# EAGLE schematic logic (EAGLE 9.6.2)
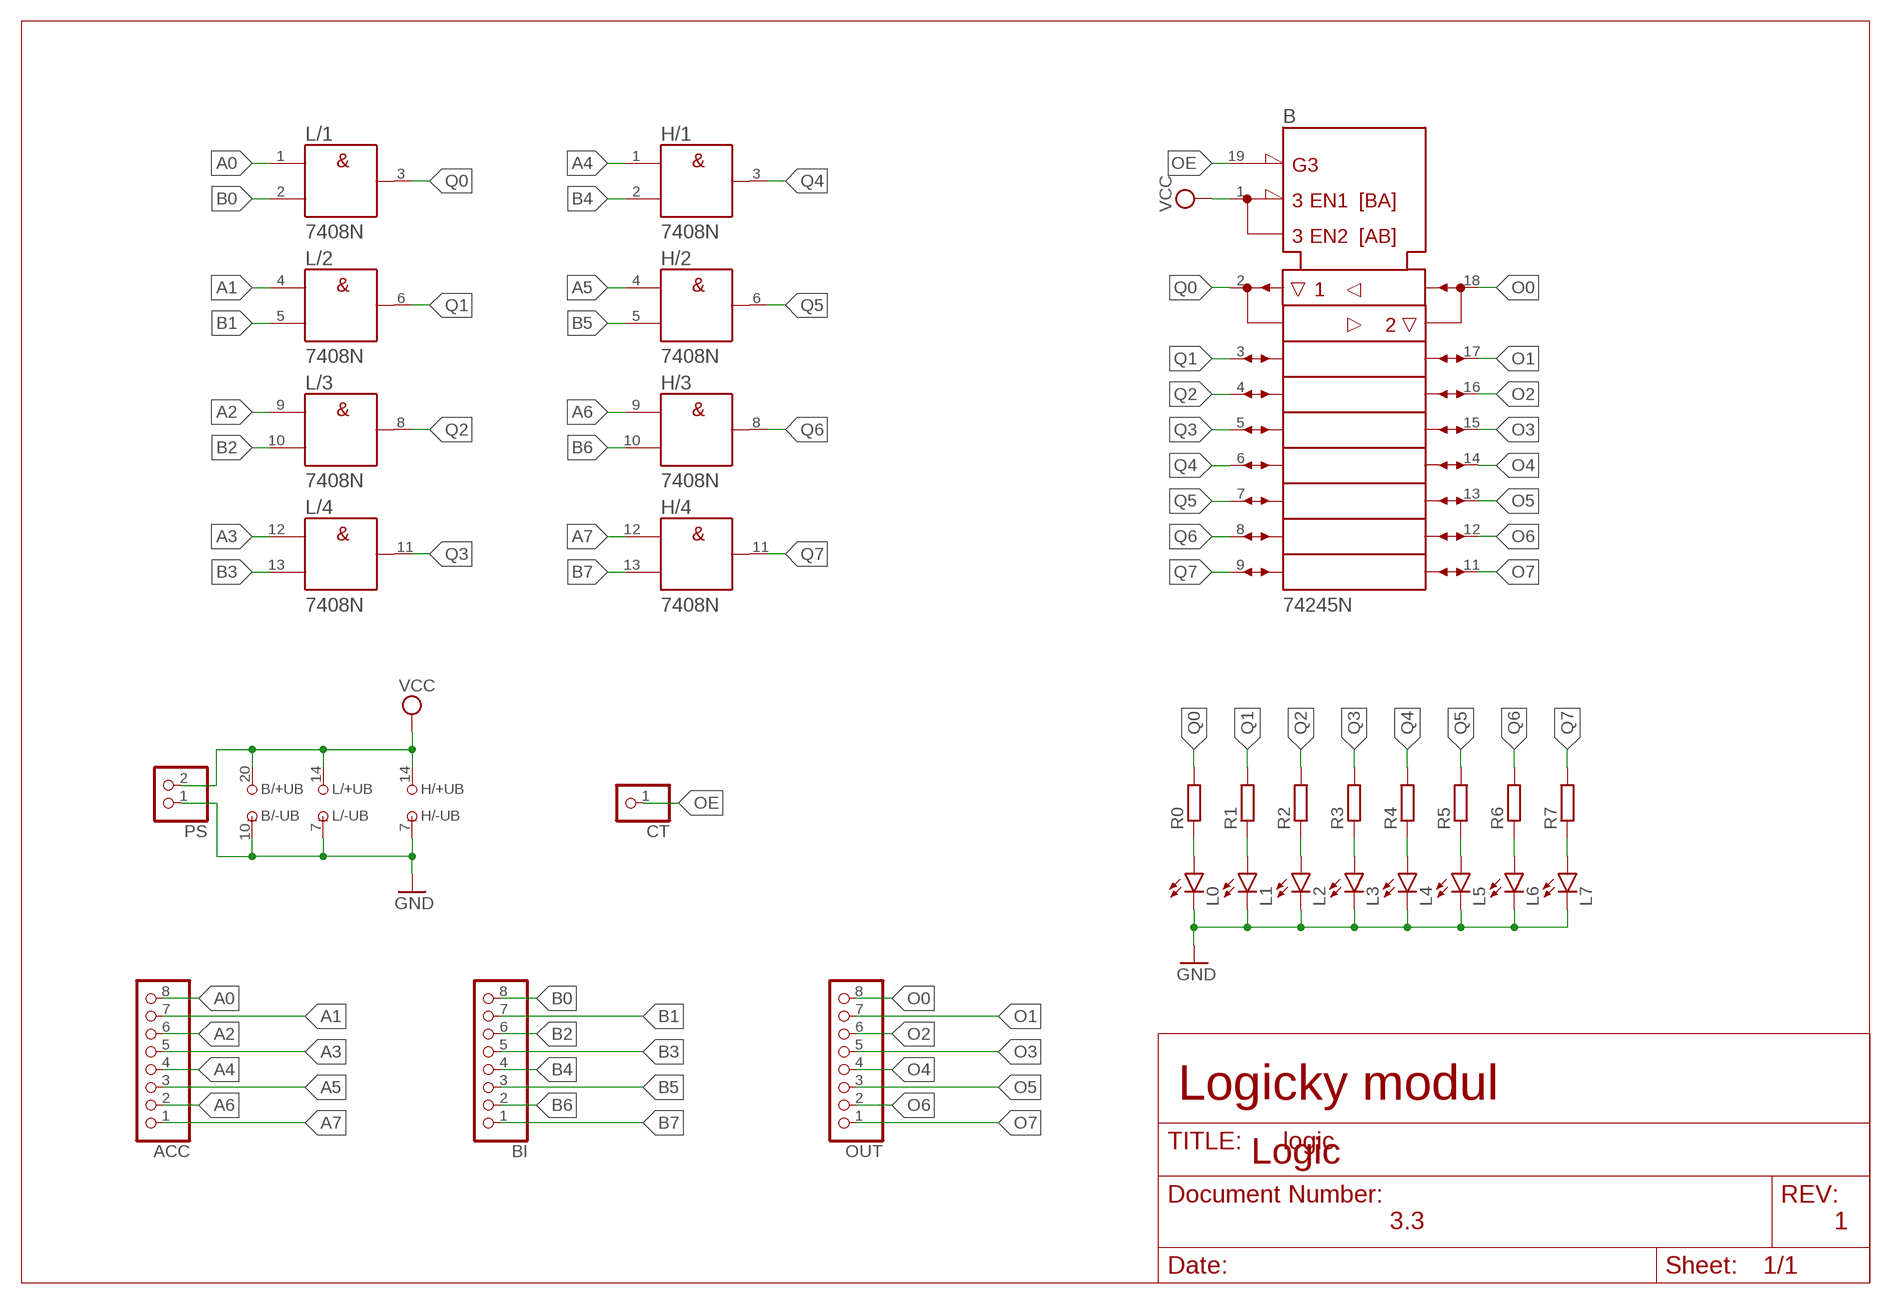
[diagram p0: schematic, sheet 1]

## Parts
ACC  PINHD-1X8  [1X08]
B  74245N  [DIL20]
BI  PINHD-1X8  [1X08]
CT  PINHD-1X1  [1X01]
H  7408N  [DIL14]
L  7408N  [DIL14]
L0  LED5MM  [LED5MM]
L1  LED5MM  [LED5MM]
L2  LED5MM  [LED5MM]
L3  LED5MM  [LED5MM]
L4  LED5MM  [LED5MM]
L5  LED5MM  [LED5MM]
L6  LED5MM  [LED5MM]
L7  LED5MM  [LED5MM]
OUT  PINHD-1X8  [1X08]
PS  PINHD-1X2  [1X02]
R0  R-EU_0204/7  [0204/7]
R1  R-EU_0204/7  [0204/7]
R2  R-EU_0204/7  [0204/7]
R3  R-EU_0204/7  [0204/7]
R4  R-EU_0204/7  [0204/7]
R5  R-EU_0204/7  [0204/7]
R6  R-EU_0204/7  [0204/7]
R7  R-EU_0204/7  [0204/7]

## Nets
A0: ACC.8 L.1(/1:A)
A1: ACC.7 L.4(/2:A)
A2: ACC.6 L.9(/3:A)
A3: ACC.5 L.12(/4:A)
A4: ACC.4 H.1(/1:A)
A5: ACC.3 H.4(/2:A)
A6: ACC.2 H.9(/3:A)
A7: ACC.1 H.12(/4:A)
B0: BI.8 L.2(/1:B)
B1: BI.7 L.5(/2:B)
B2: BI.6 L.10(/3:B)
B3: BI.5 L.13(/4:B)
B4: BI.4 H.2(/1:B)
B5: BI.3 H.5(/2:B)
B6: BI.2 H.10(/3:B)
B7: BI.1 H.13(/4:B)
GND: B.10(-UB) H.7(/-UB:-UB) L0.K(C) L1.K(C) L2.K(C) L3.K(C) L4.K(C) L5.K(C) L6.K(C) L7.K(C) L.7(/-UB:-UB) PS.1
N$1: L0.A R0.1
N$4: L1.A R1.1
N$7: L2.A R2.1
N$10: L3.A R3.1
N$13: L4.A R4.1
N$16: L5.A R5.1
N$19: L6.A R6.1
N$22: L7.A R7.1
O0: B.18(B1) OUT.8
O1: B.17(B2) OUT.7
O2: B.16(B3) OUT.6
O3: B.15(B4) OUT.5
O4: B.14(B5) OUT.4
O5: B.13(B6) OUT.3
O6: B.12(B7) OUT.2
O7: B.11(B8) OUT.1
OE: B.19(!G) CT.1
Q0: B.2(A1) L.3(/1:Y) R0.2
Q1: B.3(A2) L.6(/2:Y) R1.2
Q2: B.4(A3) L.8(/3:Y) R2.2
Q3: B.5(A4) L.11(/4:Y) R3.2
Q4: B.6(A5) H.3(/1:Y) R4.2
Q5: B.7(A6) H.6(/2:Y) R5.2
Q6: B.8(A7) H.8(/3:Y) R6.2
Q7: B.9(A8) H.11(/4:Y) R7.2
VCC: B.1(DIR) B.20(+UB) H.14(/+UB:+UB) L.14(/+UB:+UB) PS.2

## Notes on the sheet
- Logicky modul
- Logic
- 3.3 | 1

## Library data of the parts
ACC BI OUT = pinhead:PINHD-1X8: PIN HEADER
B = 74ttl-din:74*245: Octal BUS TRANSCEIVER, 3-state
CT = pinhead:PINHD-1X1: PIN HEADER
H L = 74ttl-din:74*08: Quad 2-input AND gate
L0 L1-L7 = led:LED: LED OSRAM: - CHIPLED LG R971, LG N971, LY N971, LG Q971, LY Q971, LO R971, LY R971 LH N974, LH R974 LS Q976, LO Q976, LY Q976 LO Q996 - Hyper CHIPLED LW Q18S LB Q993, LB Q99A, LB R99A - SideLED LS A670, LO A670, LY A670, LG A670, LP A670 LB A673, LV A673, LT A673, LW A673 LH A674 LY A675 LS A676, LA A676, LO A676, LY A676, LW A676 LS A679, LY A679, LG A679 - Hyper Micro SIDELED® LS Y876, LA Y876, LO Y876, LY Y876 LT Y87S - SmartLED LW L88C, LW L88S LB L89C, LB L89S, LG L890 LS L89K, LO L89K, LY L89K LS L896, LA L896, LO L896, LY L896 - TOPLED LS T670, LO T670, LY T670, LG T670, LP T670 LSG T670, LSP T670, LSY T670, LOP T670, LYG T670 LG T671, LOG T671, LSG T671 LB T673, LV T673, LT T673, LW T673 LH T674 LS T676, LA T676, LO T676, LY T676, LB T676, LH T676, LSB T676, LW T676 LB T67C, LV T67C, LT T67C, LS T67K, LO T67K, LY T67K, LW E67C LS E67B, LA E67B, LO E67B, LY E67B, LB E67C, LV E67C, LT E67C LW T67C LS T679, LY T679, LG T679 LS T770, LO T770, LY T770, LG T770, LP T770 LB T773, LV T773, LT T773, LW T773 LH T774 LS E675, LA E675, LY E675, LS T675 LS T776, LA T776, LO T776, LY T776, LB T776 LHGB T686 LT T68C, LB T68C - Hyper Mini TOPLED® LB M676 - Mini TOPLED Santana® LG M470 LS M47K, LO M47K, LY M47K Source: http://www.osram.convergy.de LUXEON: - LUMILED® LXK2-PW12-R00, LXK2-PW12-S00, LXK2-PW14-U00, LXK2-PW14-V00 LXK2-PM12-R00, LXK2-PM12-S00, LXK2-PM14-U00 LXK2-PE12-Q00, LXK2-PE12-R00, LXK2-PE12-S00, LXK2-PE14-T00, LXK2-PE14-U00 LXK2-PB12-K00, LXK2-PB12-L00, LXK2-PB12-M00, LXK2-PB14-N00, LXK2-PB14-P00, LXK2-PB14-Q00 LXK2-PR12-L00, LXK2-PR12-M00, LXK2-PR14-Q00, LXK2-PR14-R00 LXK2-PD12-Q00, LXK2-PD12-R00, LXK2-PD12-S00 LXK2-PH12-R00, LXK2-PH12-S00 LXK2-PL12-P00, LXK2-PL12-Q00, LXK2-PL12-R00 Source: www.luxeon.com KINGBRIGHT: KA-3528ASYC Source: www.kingbright.com
PS = pinhead:PINHD-1X2: PIN HEADER
R0 R1-R7 = rcl:R-EU_: RESISTOR, European symbol; SPICEPREFIX: R